# Altium schematic sheet TimeMux.SchDoc: LiveDesign Evaluation - Alarm Clock
size A4; Organization: Altium Limited; Address1: L3, 12a Rodborough Rd; Address2: Frenchs Forest; Address3: NSW; Address4: Australia 2086; DocumentNumber: 5; SheetNumber: 5; SheetTotal: 10
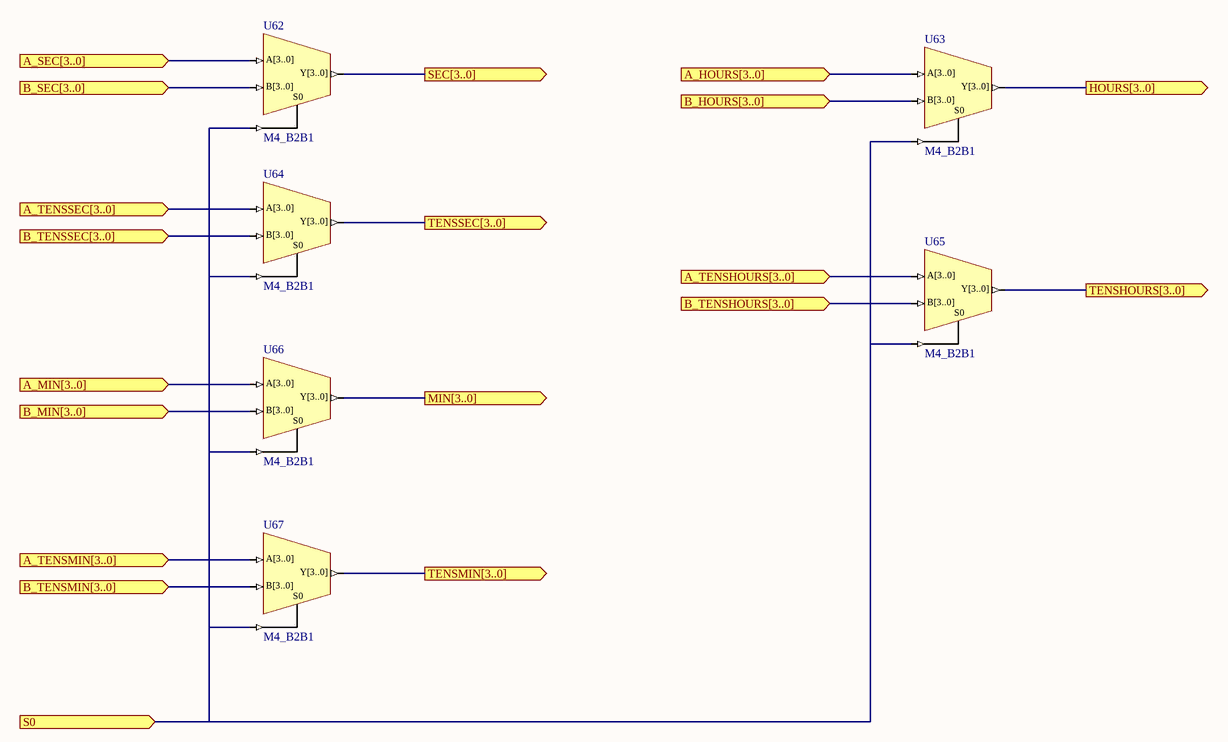
[diagram p0: TimeMux.SchDoc]

## Parts
U62  M4_B2B1
U63  M4_B2B1
U64  M4_B2B1
U65  M4_B2B1
U66  M4_B2B1
U67  M4_B2B1

## Ports
A_HOURS[3..0] (in), A_MIN[3..0] (in), A_SEC[3..0] (in), A_TENSHOURS[3..0] (in), A_TENSMIN[3..0] (in), A_TENSSEC[3..0] (in), B_HOURS[3..0] (in), B_MIN[3..0] (in), B_SEC[3..0] (in), B_TENSHOURS[3..0] (in), B_TENSMIN[3..0] (in), B_TENSSEC[3..0] (in), HOURS[3..0] (out), MIN[3..0] (out), S0 (in), SEC[3..0] (out), TENSHOURS[3..0] (out), TENSMIN[3..0] (out), TENSSEC[3..0] (out)

## Nets
A_HOURS[3..0]: U63.A[3..0] ; port A_HOURS[3..0]
A_MIN[3..0]: U66.A[3..0] ; port A_MIN[3..0]
A_SEC[3..0]: U62.A[3..0] ; port A_SEC[3..0]
A_TENSHOURS[3..0]: U65.A[3..0] ; port A_TENSHOURS[3..0]
A_TENSMIN[3..0]: U67.A[3..0] ; port A_TENSMIN[3..0]
A_TENSSEC[3..0]: U64.A[3..0] ; port A_TENSSEC[3..0]
B_HOURS[3..0]: U63.B[3..0] ; port B_HOURS[3..0]
B_MIN[3..0]: U66.B[3..0] ; port B_MIN[3..0]
B_SEC[3..0]: U62.B[3..0] ; port B_SEC[3..0]
B_TENSHOURS[3..0]: U65.B[3..0] ; port B_TENSHOURS[3..0]
B_TENSMIN[3..0]: U67.B[3..0] ; port B_TENSMIN[3..0]
B_TENSSEC[3..0]: U64.B[3..0] ; port B_TENSSEC[3..0]
HOURS[3..0]: U63.Y[3..0] ; port HOURS[3..0]
MIN[3..0]: U66.Y[3..0] ; port MIN[3..0]
S0: U62.S0 U63.S0 U64.S0 U65.S0 U66.S0 U67.S0 ; port S0
SEC[3..0]: U62.Y[3..0] ; port SEC[3..0]
TENSHOURS[3..0]: U65.Y[3..0] ; port TENSHOURS[3..0]
TENSMIN[3..0]: U67.Y[3..0] ; port TENSMIN[3..0]
TENSSEC[3..0]: U64.Y[3..0] ; port TENSSEC[3..0]

## Notes on the sheet
- Title
- Size:
- Date:
- A4
- Number:
- Time:
- Revision:
- Sheet
- of
- File:

## Library data of the parts
U62-U67 = M4_B2B1: 2x4-Bit Bus to 1x4-Bit Bus Multiplexer; ArchiveName: GENERIC; VHDLIB_SIM: GENERIC_LIB; Published: 29-Jan-2004; Publisher: Altium Limited; Core Revision: 1.00.00